# EAGLE design SBC_TMS9918A_ISA (EAGLE 9.6.2)
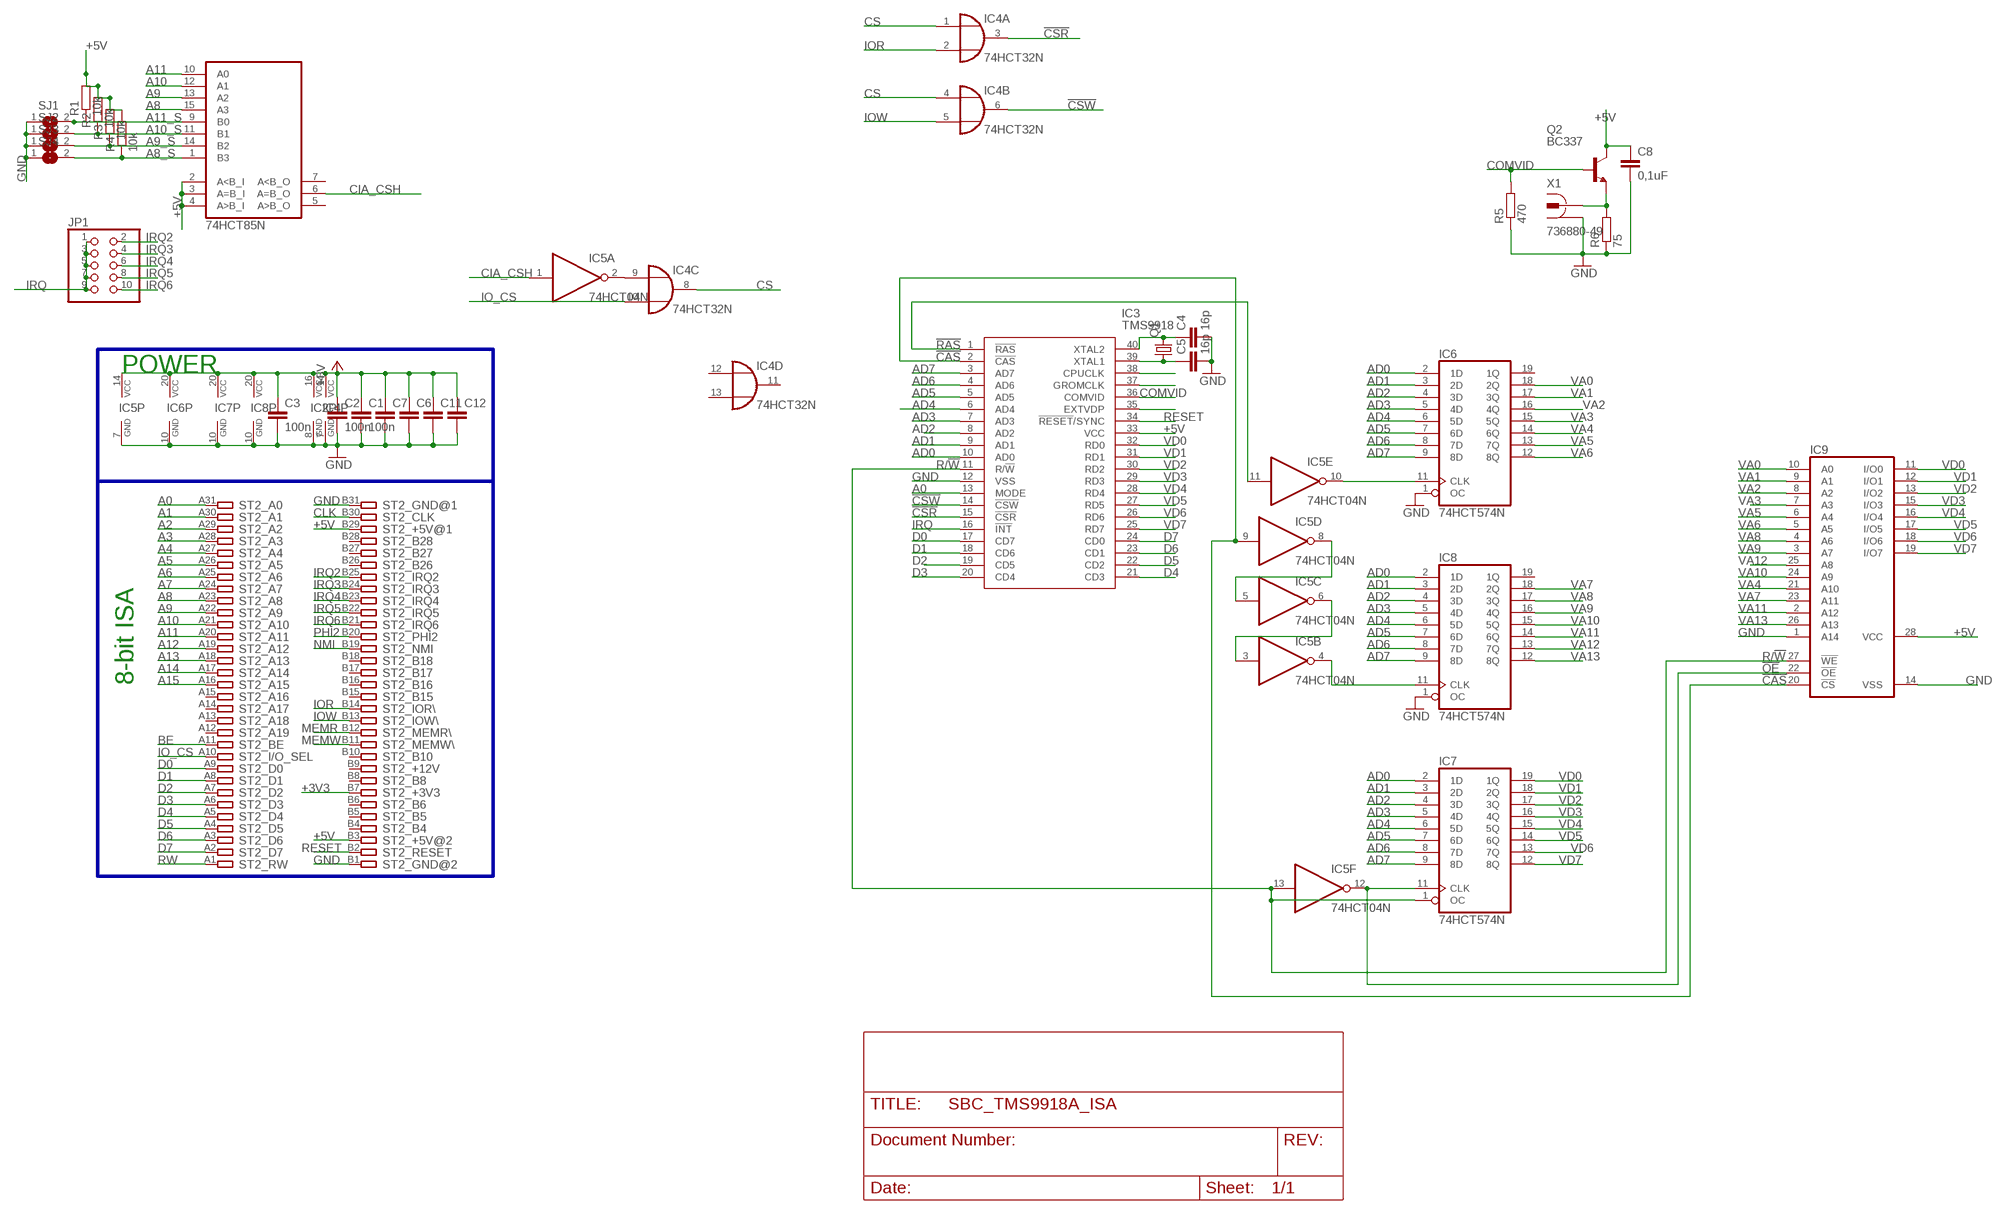
[diagram p0: schematic, sheet 1]

## Parts
C1  100n  C-EU050-025X075  [C050-025X075]
C2  100n  C-EU050-025X075  [C050-025X075]
C3  100n  C-EU050-025X075  [C050-025X075]
C4  16p  C-EU050-024X044  [C050-024X044]
C5  16p  C-EU050-024X044  [C050-024X044]
C6  C-EU050-035X075  [C050-035X075]
C7  C-EU050-035X075  [C050-035X075]
C8  0,1uF  C-EU050-024X044  [C050-024X044]
C11  C-EU050-035X075  [C050-035X075]
C12  C-EU050-035X075  [C050-035X075]
IC2  74HCT85N  [DIL16]
IC3  TMS9918  [DIP1524W53P254L5310H508Q40N]
IC4  74HCT32N  [DIL14]
IC5  74HCT04N  [DIL14]
IC6  74HCT574N  [DIL20]
IC7  74HCT574N  [DIL20]
IC8  74HCT574N  [DIL20]
IC9  62256P  [DIL28-6]
JP1  PINHD-2X5  [2X05]
Q1  CRYSTALHC49S  [HC49/S]
Q2  BC337  [TO92]
R1  10k  R-EU_0207/7  [0207/7]
R2  10k  R-EU_0207/7  [0207/7]
R3  10k  R-EU_0207/7  [0207/7]
R4  10k  R-EU_0207/7  [0207/7]
R5  470  R-EU_0207/7  [0207/7]
R6  75  R-EU_0207/7  [0207/7]
SJ1  SJ  [SJ]
SJ2  SJ  [SJ]
SJ3  SJ  [SJ]
SJ4  SJ  [SJ]
ST2  IBM8BIT_ISASHORT  [APP_2X32_SHORT]
X1  736880-49  [736880-49]

## Nets
!CAS: IC3.2(!CAS) IC5.9(D:I) IC9.20(!CS)
!CSR: IC3.15(!CSR) IC4.3(A:O)
!CSW: IC3.14(!CSW) IC4.6(B:O)
!OE: IC5.12(F:O) IC7.11(CLK) IC9.22(!OE)
!RAS: IC3.1(!RAS) IC5.11(E:I)
+3V3: ST2.B7
+5V [power]: C1.1 C2.1 C3.1 C6.1 C7.1 C8.1 C11.1 C12.1 IC2.2(A<B_I) IC2.3(A=B_I) IC2.4(A>B_I) IC2.16(VCC) IC3.33(VCC) IC4.14(P:VCC) IC5.14(P:VCC) IC6.20(VCC) IC7.20(VCC) IC8.20(VCC) IC9.28(VCC) Q2.3(C) R1.2 R2.2 R3.2 R4.2 ST2.B3 ST2.B29
A0: IC3.13(MODE) ST2.A31
A1: ST2.A30
A2: ST2.A29
A3: ST2.A28
A4: ST2.A27
A5: ST2.A26
A6: ST2.A25
A7: ST2.A24
A8: IC2.15(A3) ST2.A23
A8_S: IC2.1(B3) R4.1 SJ4.2
A9: IC2.13(A2) ST2.A22
A9_S: IC2.14(B2) R3.1 SJ3.2
A10: IC2.12(A1) ST2.A21
A10_S: IC2.11(B1) R2.1 SJ2.2
A11: IC2.10(A0) ST2.A20
A11_S: IC2.9(B0) R1.1 SJ1.2
A12: ST2.A19
A13: ST2.A18
A14: ST2.A17
A15: ST2.A16
AD0: IC3.10(AD0) IC6.2(1D) IC7.2(1D) IC8.2(1D)
AD1: IC3.9(AD1) IC6.3(2D) IC7.3(2D) IC8.3(2D)
AD2: IC3.8(AD2) IC6.4(3D) IC7.4(3D) IC8.4(3D)
AD3: IC3.7(AD3) IC6.5(4D) IC7.5(4D) IC8.5(4D)
AD4: IC3.6(AD4) IC6.6(5D) IC7.6(5D) IC8.6(5D)
AD5: IC3.5(AD5) IC6.7(6D) IC7.7(6D) IC8.7(6D)
AD6: IC3.4(AD6) IC6.8(7D) IC7.8(7D) IC8.8(7D)
AD7: IC3.3(AD7) IC6.9(8D) IC7.9(8D) IC8.9(8D)
BE: ST2.A11
CIA_CSH: IC2.6(A=B_O) IC5.1(A:I)
CLK: ST2.B30
COMVID: IC3.36(COMVID) Q2.2(B) R5.2
CS: IC4.1(A:I0) IC4.4(B:I0) IC4.8(C:O)
D0: IC3.17(CD7) ST2.A9
D1: IC3.18(CD6) ST2.A8
D2: IC3.19(CD5) ST2.A7
D3: IC3.20(CD4) ST2.A6
D4: IC3.21(CD3) ST2.A5
D5: IC3.22(CD2) ST2.A4
D6: IC3.23(CD1) ST2.A3
D7: IC3.24(CD0) ST2.A2
GND [power]: C1.2 C2.2 C3.2 C4.2 C5.2 C6.2 C7.2 C8.2 C11.2 C12.2 IC2.8(GND) IC3.12(VSS) IC4.7(P:GND) IC5.7(P:GND) IC6.1(OC) IC6.10(GND) IC7.10(GND) IC8.1(OC) IC8.10(GND) IC9.1(A14) IC9.14(VSS) R5.1 R6.1 SJ1.1 SJ2.1 SJ3.1 SJ4.1 ST2.B1 ST2.B31 X1.1 X1.1@1 X1.1@2
IO_CS: IC4.10(C:I1) ST2.A10
IOR: IC4.2(A:I1) ST2.B14
IOW: IC4.5(B:I1) ST2.B13
IRQ: IC3.16(!INT) JP1.1 JP1.3 JP1.5 JP1.7 JP1.9
IRQ2: JP1.2 ST2.B25
IRQ3: JP1.4 ST2.B24
IRQ4: JP1.6 ST2.B23
IRQ5: JP1.8 ST2.B22
IRQ6: JP1.10 ST2.B21
MEMR: ST2.B12
MEMW: ST2.B11
N$2: IC4.9(C:I0) IC5.2(A:O)
N$3: Q2.1(E) R6.2 X1.2
N$14: IC5.10(E:O) IC6.11(CLK)
N$15: IC5.5(C:I) IC5.8(D:O)
N$16: IC5.3(B:I) IC5.6(C:O)
N$17: IC5.4(B:O) IC8.11(CLK)
N$22: C4.1 IC3.40(XTAL2) Q1.2
N$23: C5.1 IC3.39(XTAL1) Q1.1
N$24: IC3.38(CPUCLK)
N$25: IC3.37(GROMCLK)
N$27: IC3.35(EXTVDP)
NMI: ST2.B19
PHI2: ST2.B20
R/!W: IC3.11(R/!W) IC5.13(F:I) IC7.1(OC) IC9.27(!WE)
RESET: IC3.34(!RESET!/SYNC) ST2.B2
RW: ST2.A1
VA0: IC6.18(2Q) IC9.10(A0)
VA1: IC6.17(3Q) IC9.9(A1)
VA2: IC6.16(4Q) IC9.8(A2)
VA3: IC6.15(5Q) IC9.7(A3)
VA4: IC6.14(6Q) IC9.21(A10)
VA5: IC6.13(7Q) IC9.6(A4)
VA6: IC6.12(8Q) IC9.5(A5)
VA7: IC8.18(2Q) IC9.23(A11)
VA8: IC8.17(3Q) IC9.4(A6)
VA9: IC8.16(4Q) IC9.3(A7)
VA10: IC8.15(5Q) IC9.24(A9)
VA11: IC8.14(6Q) IC9.2(A12)
VA12: IC8.13(7Q) IC9.25(A8)
VA13: IC8.12(8Q) IC9.26(A13)
VD0: IC3.32(RD0) IC7.19(1Q) IC9.11(I/O0)
VD1: IC3.31(RD1) IC7.18(2Q) IC9.12(I/O1)
VD2: IC3.30(RD2) IC7.17(3Q) IC9.13(I/O2)
VD3: IC3.29(RD3) IC7.16(4Q) IC9.15(I/O3)
VD4: IC3.28(RD4) IC7.15(5Q) IC9.16(I/O4)
VD5: IC3.27(RD5) IC7.14(6Q) IC9.17(I/O5)
VD6: IC3.26(RD6) IC7.13(7Q) IC9.18(I/O6)
VD7: IC3.25(RD7) IC7.12(8Q) IC9.19(I/O7)
Unconnected: IC2.5(A>B_O) IC2.7(A<B_O) IC4.11(D:O) IC4.12(D:I0) IC4.13(D:I1) IC6.19(1Q) IC8.19(1Q) ST2.A12 ST2.A13 ST2.A14 ST2.A15 ST2.B4 ST2.B5 ST2.B6 ST2.B8 ST2.B9 ST2.B10 ST2.B15 ST2.B16 ST2.B17 ST2.B18 ST2.B26 ST2.B27 ST2.B28

## Buses
A8,A9,A10,A11,ACIA_CS,IO_CS,IO_CS_N,N$3,N$4,N$8

## Notes on the sheet
- POWER
- 8-bit ISA

## Library data of the parts
C1-C3 = rcl:C-EU: CAPACITOR, European symbol
C4-C8 C11 C12 = rcl:C-EU: CAPACITOR, European symbol; SPICEPREFIX: C
IC2 = 74xx-eu:74*85: 4-bit magnitude COMPARATOR
IC3 = TMS9918:TMS9918: Video Display Processor, DIP-40 Source: Datasheet <http://www.bitsavers.org/components/ti/TMS9900/TMS9918A_TMS9928A_TMS9929A_Video_Display_Processors_Data_Manual_Nov82.pdf>; DESCRIPTION: Video Display Processor, DIP-40; HEIGHT: 5.08mm; MANUFACTURER_NAME: Texas Instruments; MANUFACTURER_PART_NUMBER: TMS9918
IC4 = 74xx-eu:74*32: Quad 2-input OR gate
IC5 = 74xx-eu:74*04: Hex INVERTER
IC6-IC8 = 74xx-eu:74*574: 8-bit D type FLIP FLOP bus driver
IC9 = memory-hitachi:62256P: MEMORY; OC_FARNELL: unknown; OC_NEWARK: unknown
JP1 = pinhead:PINHD-2X5: PIN HEADER
Q1 = crystal:CRYSTAL: CRYSTAL; OC_FARNELL: 1667008; OC_NEWARK: unknown
Q2 = transistor-npn:BC337*: NPN Transistor
R1-R6 = rcl:R-EU_: RESISTOR, European symbol; SPICEPREFIX: R
SJ1-SJ4 = jumper:SJ: SMD solder JUMPER
ST2 = TiRoRiN_Libs:IBM8BIT_ISA: 8-bit CARD IBM/PC-AT
X1 = con-conrad:736880-49: Cinch Connector ( RCA Jack ) Cinch-Einbaukupplung 90º 72345 Vernickelt BKL Electronic Source: Conrad <http://www.conrad.de/ce/de/product/736880>

## Net classes
0 default: width 0.381 mm, drill 0.2 mm, clearance 0.254 mm
1 power: width 0.508 mm, drill 0.66 mm, clearance 0.254 mm to class 0, clearance 0.254 mm
2 data: width 0.381 mm, drill 0.66 mm, clearance 0.254 mm to class 0, clearance 0.254 mm to class 1, clearance 0.254 mm

## Board
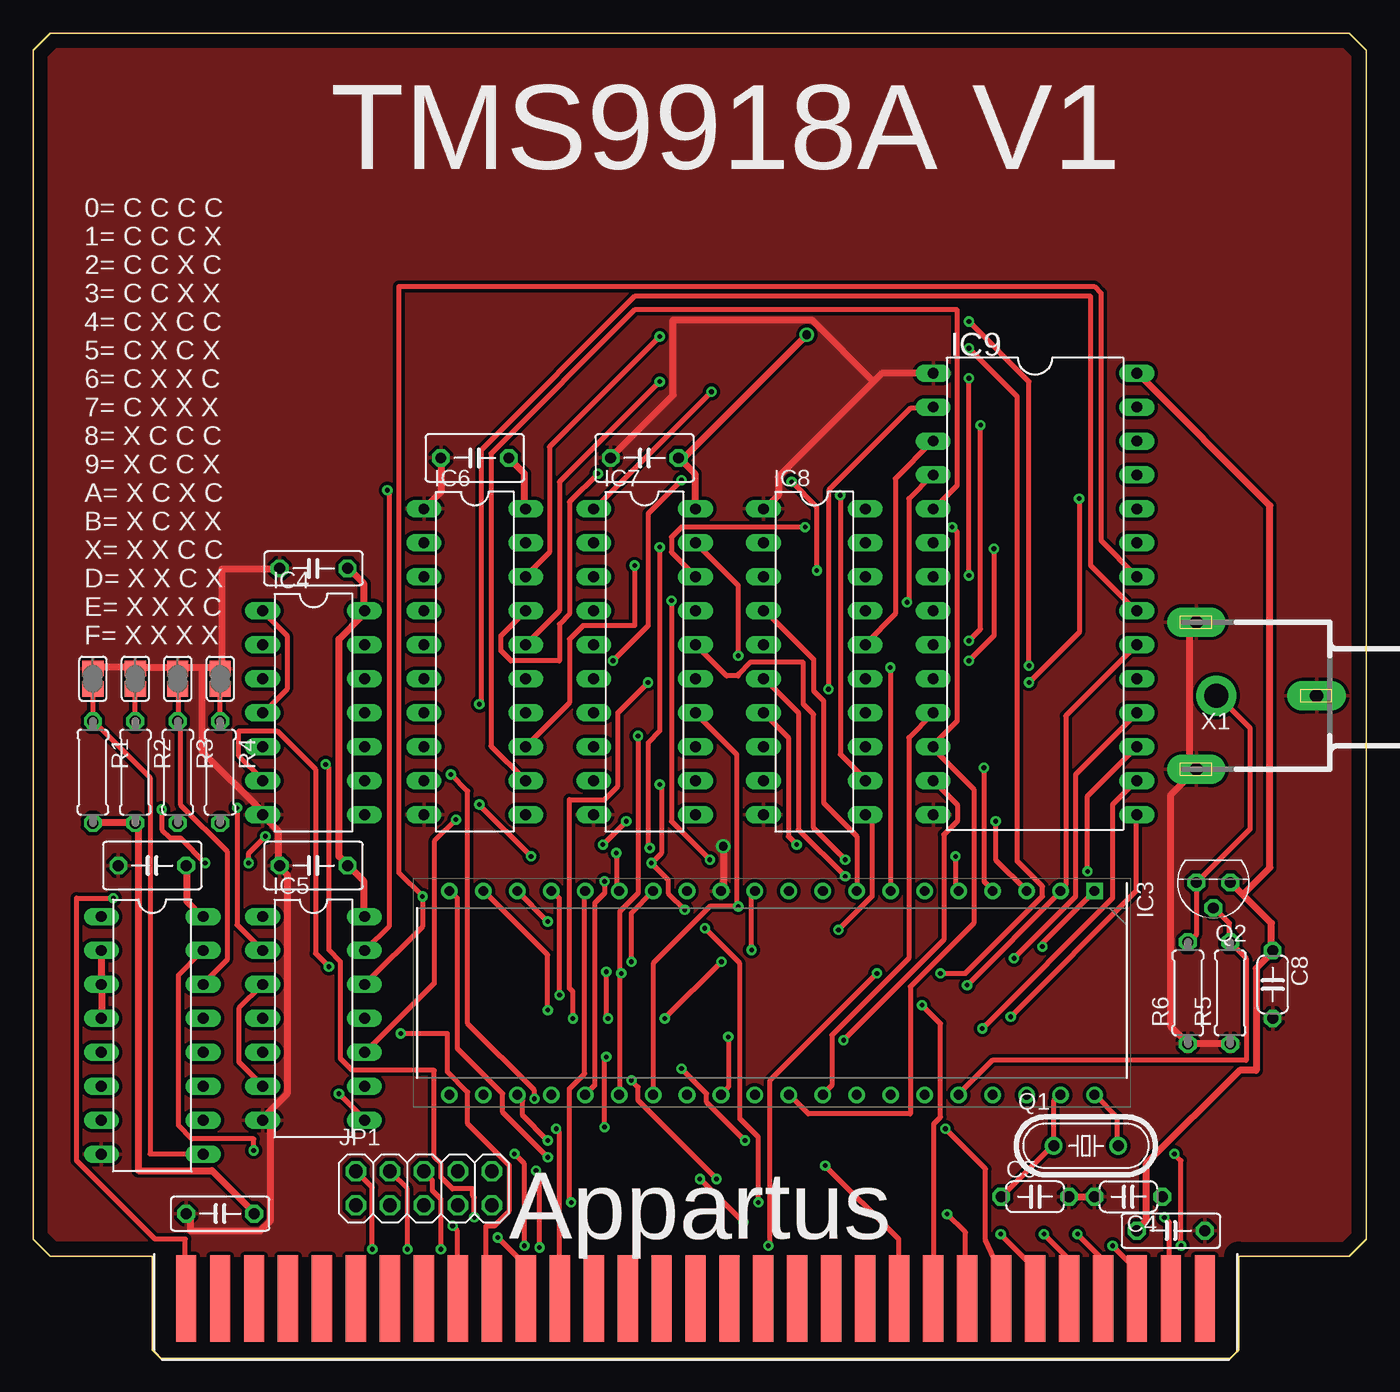
[diagram p1: board, top side]
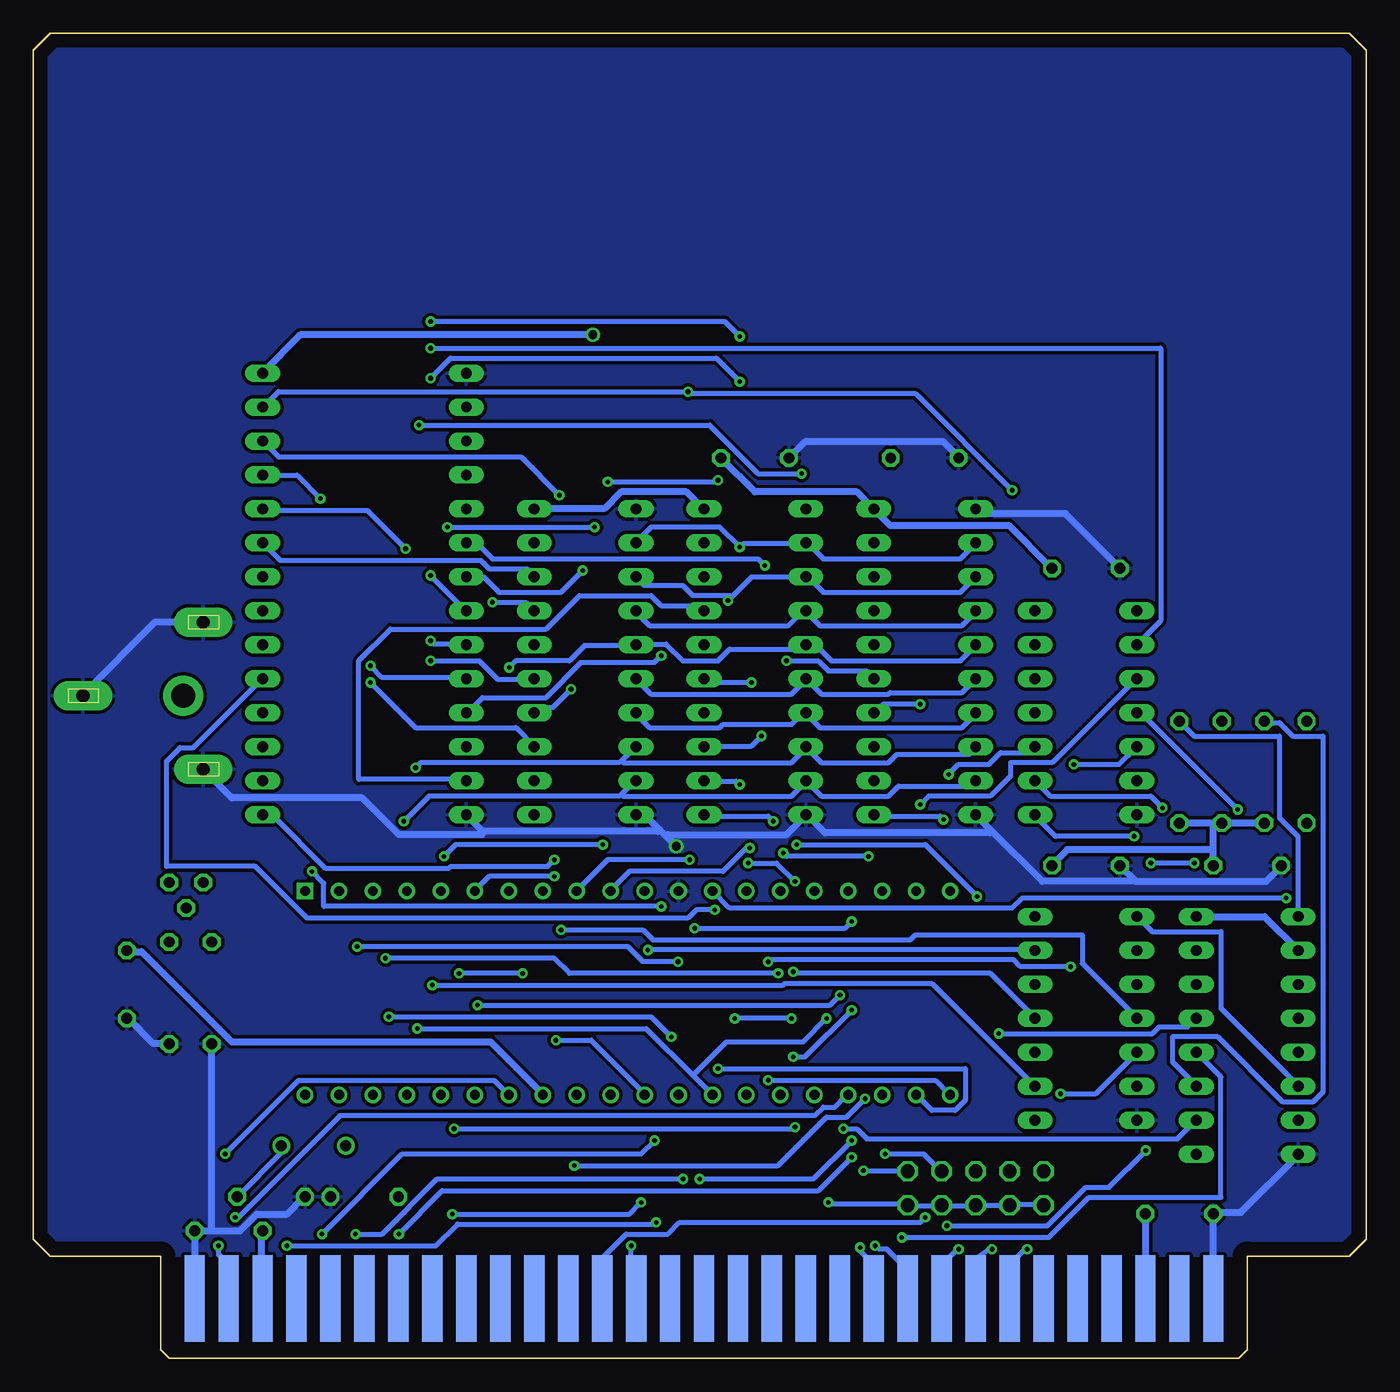
[diagram p2: board, bottom side, seen from below]

Size 99.7 x 99.06 mm. Coordinates in mm from the lower left corner, seen from the top.
Copper layers (1*16): Top 0.035mm / dielectric 1.5mm / Bottom 0.035mm
Design rules "appartus": minimum track width 6mil, minimum drill 0.35mm, track to track 6mil, track to pad 6mil, pad to pad 6mil, via to via 6mil, smd to smd 6mil, copper to edge 40mil, drill to drill 6mil, minimum pad ring 10mil, minimum via ring 8mil, stop-mask expansion 4mil, vias tented up to drill 0mil, thermal gap 10mil

### Footprints (pad centres in the part's own frame; a part is rotated, then mirrored left to right if it is on the bottom)
C050-025X075 = drill 0.813 octagon: 1 -2.54,0; 2 2.54,0
C050-024X044 = drill 0.813 octagon: 1 -2.54,0; 2 2.54,0
C050-035X075 = drill 0.813 octagon: 1 -2.54,0; 2 2.54,0
DIL16 = drill 0.813 long: 1 -8.89,-3.81; 2 -6.35,-3.81; 3 -3.81,-3.81; 4 -1.27,-3.81; 5 1.27,-3.81; 6 3.81,-3.81; 7 6.35,-3.81; 8 8.89,-3.81; 9 8.89,3.81; 10 6.35,3.81; 11 3.81,3.81; 12 1.27,3.81; 13 -1.27,3.81; 14 -3.81,3.81; 15 -6.35,3.81; 16 -8.89,3.81
DIP1524W53P254L5310H508Q40N = drill 0.733 pad 1.133 square: 1 -7.62,24.13 | drill 0.733 pad 1.133: 2 -7.62,21.59; 3 -7.62,19.05; 4 -7.62,16.51; 5 -7.62,13.97; 6 -7.62,11.43; 7 -7.62,8.89; 8 -7.62,6.35; 9 -7.62,3.81; 10 -7.62,1.27; 11 -7.62,-1.27; 12 -7.62,-3.81; 13 -7.62,-6.35; 14 -7.62,-8.89; 15 -7.62,-11.43; 16 -7.62,-13.97; 17 -7.62,-16.51; 18 -7.62,-19.05; 19 -7.62,-21.59; 20 -7.62,-24.13; 21 7.62,-24.13; 22 7.62,-21.59; 23 7.62,-19.05; 24 7.62,-16.51; 25 7.62,-13.97; 26 7.62,-11.43; 27 7.62,-8.89; 28 7.62,-6.35; 29 7.62,-3.81; 30 7.62,-1.27; 31 7.62,1.27; 32 7.62,3.81; 33 7.62,6.35; 34 7.62,8.89; 35 7.62,11.43; 36 7.62,13.97; 37 7.62,16.51; 38 7.62,19.05; 39 7.62,21.59; 40 7.62,24.13
DIL14 = drill 0.813 long: 1 -7.62,-3.81; 2 -5.08,-3.81; 3 -2.54,-3.81; 4 0,-3.81; 5 2.54,-3.81; 6 5.08,-3.81; 7 7.62,-3.81; 8 7.62,3.81; 9 5.08,3.81; 10 2.54,3.81; 11 0,3.81; 12 -2.54,3.81; 13 -5.08,3.81; 14 -7.62,3.81
DIL20 = drill 0.813 long: 1 -11.43,-3.81; 2 -8.89,-3.81; 3 -6.35,-3.81; 4 -3.81,-3.81; 5 -1.27,-3.81; 6 1.27,-3.81; 7 3.81,-3.81; 8 6.35,-3.81; 9 8.89,-3.81; 10 11.43,-3.81; 11 11.43,3.81; 12 8.89,3.81; 13 6.35,3.81; 14 3.81,3.81; 15 1.27,3.81; 16 -1.27,3.81; 17 -3.81,3.81; 18 -6.35,3.81; 19 -8.89,3.81; 20 -11.43,3.81
DIL28-6 = drill 0.813 long: 1 -16.51,-7.62; 2 -13.97,-7.62; 3 -11.43,-7.62; 4 -8.89,-7.62; 5 -6.35,-7.62; 6 -3.81,-7.62; 7 -1.27,-7.62; 8 1.27,-7.62; 9 3.81,-7.62; 10 6.35,-7.62; 11 8.89,-7.62; 12 11.43,-7.62; 13 13.97,-7.62; 14 16.51,-7.62; 15 16.51,7.62; 16 13.97,7.62; 17 11.43,7.62; 18 8.89,7.62; 19 6.35,7.62; 20 3.81,7.62; 21 1.27,7.62; 22 -1.27,7.62; 23 -3.81,7.62; 24 -6.35,7.62; 25 -8.89,7.62; 26 -11.43,7.62; 27 -13.97,7.62; 28 -16.51,7.62
2X05 = drill 1.016 octagon: 1 -5.08,-1.27; 2 -5.08,1.27; 3 -2.54,-1.27; 4 -2.54,1.27; 5 0,-1.27; 6 0,1.27; 7 2.54,-1.27; 8 2.54,1.27; 9 5.08,-1.27; 10 5.08,1.27
HC49/S = drill 0.813: 1 -2.413,0; 2 2.413,0
TO92 = drill 0.813 octagon: 1 1.27,0; 2 0,1.905; 3 -1.27,0
0207/7 = drill 0.813 octagon: 1 -3.81,0; 2 3.81,0
SJ = smd 1.168 x 1.6: 1 -0.762,0; 2 0.762,0
APP_2X32_SHORT = smd 1.524 x 6.477: A1 38.1,-44.45; A2 35.56,-44.45; A3 33.02,-44.45; A4 30.48,-44.45; A5 27.94,-44.45; A6 25.4,-44.45; A7 22.86,-44.45; A8 20.32,-44.45; A9 17.78,-44.45; A10 15.24,-44.45; A11 12.7,-44.45; A12 10.16,-44.45; A13 7.62,-44.45; A14 5.08,-44.45; A15 2.54,-44.45; A16 0,-44.45; A17 -2.54,-44.45; A18 -5.08,-44.45; A19 -7.62,-44.45; A20 -10.16,-44.45; A21 -12.7,-44.45; A22 -15.24,-44.45; A23 -17.78,-44.45; A24 -20.32,-44.45; A25 -22.86,-44.45; A26 -25.4,-44.45; A27 -27.94,-44.45; A28 -30.48,-44.45; A29 -33.02,-44.45; A30 -35.56,-44.45; A31 -38.1,-44.45 | smd 1.524 x 6.477 bottom: B1 38.1,-44.45; B2 35.56,-44.45; B3 33.02,-44.45; B4 30.48,-44.45; B5 27.94,-44.45; B6 25.4,-44.45; B7 22.86,-44.45; B8 20.32,-44.45; B9 17.78,-44.45; B10 15.24,-44.45; B11 12.7,-44.45; B12 10.16,-44.45; B13 7.62,-44.45; B14 5.08,-44.45; B15 2.54,-44.45; B16 0,-44.45; B17 -2.54,-44.45; B18 -5.08,-44.45; B19 -7.62,-44.45; B20 -10.16,-44.45; B21 -12.7,-44.45; B22 -15.24,-44.45; B23 -17.78,-44.45; B24 -20.32,-44.45; B25 -22.86,-44.45; B26 -25.4,-44.45; B27 -27.94,-44.45; B28 -30.48,-44.45; B29 -33.02,-44.45; B30 -35.56,-44.45; B31 -38.1,-44.45
736880-49 = drill 1 pad 2.2 long: 1 -3.92,0; 1@1 5.08,-5.5; 1@2 5.08,5.5 | drill 1.8 pad 3: 2 3.58,0

### Placement (x,y rotation side)
C1  13.97,10.8 180 top
C2  85.09,9.53 0 top
C3  20.96,59.05 180 top
C4  81.92,12.07 180 top
C5  74.93,12.07 0 top
C6  8.89,36.83 180 top
C7  20.96,36.83 180 top
C8  92.71,27.94 270 top
C11  33.02,67.31 180 top
C12  45.72,67.31 180 top
IC2  8.89,24.13 270 top
IC3  55.25,27.31 270 top
IC4  20.96,48.26 270 top
IC5  20.96,25.4 270 top
IC6  33.02,52.07 270 top
IC7  45.72,52.07 270 top
IC8  58.42,52.07 270 top
IC9  74.93,57.15 270 top
JP1  29.21,12.7 0 top
Q1  78.74,15.88 0 top
Q2  88.27,35.56 180 top
R1  4.45,43.82 270 top
R2  7.62,43.82 270 top
R3  10.8,43.82 270 top
R4  13.97,43.82 270 top
R5  89.54,27.31 90 top
R6  86.36,27.31 90 top
SJ1  4.45,50.8 270 top
SJ2  7.62,50.8 270 top
SJ3  10.8,50.8 270 top
SJ4  13.97,50.8 270 top
ST2  49.53,48.9 0 top
X1  92.08,49.53 180 top

### Tracks (layer width: path | path; a pad name or v marks a point on that pad's centre or on a via)
!CAS  (via drill 0.35)
  Top 0.381: IC9.20 77.23,48.02 77.23,35.4 76.86,35.02 IC3.2 76.73,34.77 v69.86,27.9
  Bottom 0.381: v69.86,27.9 43.61,27.9 43.48,28.02 32.48,28.02 24.86,20.4 IC5.9
!CSR  (via drill 0.35)
  Top 0.381: v43.61,37.77 43.61,35.15 43.73,35.02 IC3.15 | v33.36,41.4 v37.23,37.52
  Bottom 0.381: v43.61,37.77 43.36,37.52 v37.23,37.52 | v33.36,41.4 32.73,42.02 28.11,42.02 26.61,43.52 26.61,44.52 23.48,44.52 17.23,50.77 IC4.3
!CSW  (via drill 0.35)
  Top 0.381: v44.73,29.65 44.73,33.27 46.36,34.9 IC3.14 | v22.11,29.27 21.11,30.27 21.11,44.02 18.23,46.9 15.36,46.9 15.36,45.02 17.11,43.27 IC4.6
  Bottom 0.381: v44.73,29.65 44.61,29.77 26.36,29.77 25.86,29.27 v22.11,29.27
!OE  (via drill 0.35)
  Top 0.381: v44.36,40.15 v42.61,38.4 | IC5.12 24.86,28.02 29.11,32.27 v29.11,34.52 27.36,36.27 27.36,80.15 79.36,80.15 79.86,79.65 79.86,61.15 82.48,58.52 IC9.22
  Bottom 0.381: v29.11,34.52 32.98,38.4 v42.61,38.4 | v44.36,40.15 44.73,40.52 49.48,40.52 IC7.11
!RAS  (via drill 0.35)
  Top 0.381: v75.48,30.77 75.48,31.02 79.36,34.9 IC3.1 | v47.23,25.4 v51.48,29.65 | v42.98,25.4 42.86,25.52 v42.86,28.9
  Bottom 0.381: v75.48,30.77 55.23,30.77 54.11,29.65 v51.48,29.65 | v42.98,25.4 v47.23,25.4 | v42.86,28.9 42.73,28.77 28.11,28.77 24.86,25.52 IC5.11
+5V  (via drill 0.66)
  Top 0.508: 90.48,34.65 92.61,32.52 92.61,30.52 C8.1 92.61,30.27 91.48,29.15 91.48,21.52 90.23,21.52 83.23,14.52 83.23,10.27 82.61,9.65 C2.1 | 90.48,34.65 89.61,35.52 Q2.3 | IC9.28 82.61,73.65 92.51,63.74 92.51,36.68 90.48,34.65 | IC7.20 49.48,63.52 49.48,66.15 48.36,67.27 C12.1 48.61,67.27 v57.86,76.52 | C3.1 23.61,59.02 24.73,57.9 24.73,55.9 IC4.14 24.73,55.65 22.86,53.77 22.86,37.52 23.36,37.02 C7.1 23.61,36.77 24.73,35.65 24.73,33.02 IC5.14 | C11.1 35.61,67.27 36.73,66.15 36.73,63.52 IC6.20 | IC2.4 5.11,25.52 5.11,27.9 IC2.3 5.11,28.15 5.11,30.4 IC2.2 | R1.2 4.48,40.02 7.61,40.02 R2.2 7.86,39.9 7.86,14.02 13.36,14.02 16.48,10.9 C1.1 | IC2.16 12.61,33.02 11.48,34.15 11.48,36.77 C6.1
  Bottom 0.508: C2.1 82.61,9.52 82.61,4.52 ST2.B3 | IC3.33 61.61,19.77 65.48,23.65 84.86,23.65 91.61,30.4 92.61,30.4 C8.1 | IC8.20 62.23,63.52 56.98,63.52 55.73,64.77 50.86,64.77 49.61,63.52 IC7.20 | C3.1 23.61,59.15 26.73,62.27 35.61,62.27 36.73,63.4 IC6.20 36.98,63.65 38.11,64.77 45.73,64.77 48.23,67.27 C12.1 | C1.1 16.48,10.77 16.48,4.52 ST2.B29 | 11.48,40.02 13.86,40.02 R4.2 | 11.48,40.02 10.86,40.02 R3.2 10.61,40.02 7.73,40.02 R2.2 | 11.48,40.02 11.48,38.02 | 11.48,38.02 11.48,36.9 C6.1 | IC2.16 7.61,33.02 5.11,30.52 IC2.2 | 11.48,38.02 22.36,38.02 23.48,36.9 C7.1 | v57.86,76.52 79.73,76.52 82.48,73.77 IC9.28
A0  (via drill 0.35)
  Top 0.381: v5.98,34.4 3.23,34.4 3.23,14.77 9.11,8.9 11.36,8.9 11.36,4.52 ST2.A31
  Bottom 0.381: v5.98,34.4 25.73,34.4 26.48,33.65 47.61,33.65 48.86,34.9 IC3.13
A8  (via drill 0.35)
  Top 0.381: v16.48,15.52 16.48,16.4 11.86,16.4 10.86,17.4 10.86,28.65 12.61,30.4 IC2.15 | v31.36,9.9 31.73,9.52 31.73,4.52 ST2.A23
  Bottom 0.381: v16.48,15.52 19.23,12.77 20.98,12.77 23.86,9.9 v31.36,9.9
A8_S
  Top 0.381: SJ4.2 13.98,50.02 13.98,47.65 R4.1
  Bottom 0.381: IC2.1 5.11,33.02 5.11,39.02 6.48,40.4 6.48,46.52 12.86,46.52 13.86,47.52 R4.1
A9  (via drill 0.35)
  Top 0.381: v27.48,24.27 30.98,24.27 30.98,21.4 32.48,19.9 32.48,17.52 35.61,14.4 35.61,11.02 34.48,9.9 33.86,9.9 33.86,4.9 34.23,4.52 ST2.A22
  Bottom 0.381: v27.48,24.27 15.98,24.27 15.48,24.77 13.36,24.77 12.73,25.4 IC2.13
A9_S
  Top 0.381: SJ3.2 10.86,50.02 10.86,47.65 R3.1 10.98,47.52 10.98,41.4 14.48,37.9 14.48,29.77 12.73,28.02 IC2.14
A10  (via drill 0.35)
  Top 0.381: v34.73,9.02 36.73,7.02 36.73,4.52 ST2.A21
  Bottom 0.381: v34.73,9.02 23.73,9.02 20.73,12.02 10.86,12.02 10.86,21.02 12.61,22.77 IC2.12
A10_S
  Top 0.381: SJ2.2 7.61,50.02 7.61,47.65 R2.1
  Bottom 0.381: IC2.11 12.73,20.4 14.48,22.15 14.48,24.02 11.11,24.02 6.23,19.15 3.98,19.15 3.23,19.9 3.23,46.52 5.48,46.52 6.48,47.52 7.61,47.52 R2.1
A11  (via drill 0.35)
  Top 0.381: v39.11,17.15 39.36,16.9 39.36,4.52 ST2.A20
  Bottom 0.381: v39.11,17.15 38.11,17.15 37.36,16.4 14.11,16.4 12.73,17.77 IC2.10
A11_S
  Top 0.381: SJ1.2 4.48,50.02 4.48,47.65 R1.1 4.61,47.52 8.73,43.4 8.73,15.27 12.61,15.27 IC2.9
AD0  (via drill 0.35)
  Top 0.381: v46.11,38.15 45.98,38.27 45.98,46.02 46.86,46.9 v46.86,60.65
  Bottom 0.381: v46.11,38.15 46.36,38.15 48.11,36.4 55.11,36.4 56.48,35.02 IC3.10 | IC6.2 29.23,60.9 30.36,59.77 40.61,59.77 41.73,60.9 IC7.2 41.98,60.9 46.61,60.9 v46.86,60.65 48.36,62.15 53.48,62.15 54.61,61.02 IC8.2
AD1  (via drill 0.35)
  Top 0.381: v50.61,37.27 47.73,40.15 v47.73,56.65
  Bottom 0.381: v50.61,37.27 56.73,37.27 58.98,35.02 IC3.9 | IC6.3 29.23,58.4 30.36,57.27 40.61,57.27 41.73,58.4 IC7.3 41.98,58.4 45.98,58.4 v47.73,56.65 47.61,57.02 50.36,57.02 51.11,57.77 53.98,57.77 54.61,58.4 IC8.3
AD2
  Top 0.381: IC3.8 61.61,35.02 61.61,39.02 59.11,41.52 59.11,49.15 58.36,49.9 58.36,52.27 54.73,55.9 IC8.4
  Bottom 0.381: IC6.4 29.23,55.77 30.23,54.77 40.86,54.77 41.86,55.77 IC7.4 42.11,55.9 43.23,54.77 53.61,54.77 54.61,55.77 IC8.4
AD3  (via drill 0.35)
  Top 0.381: v64.11,51.65 64.11,35.02 IC3.7
  Bottom 0.381: IC6.5 29.23,53.27 30.36,52.15 39.98,52.15 41.11,53.27 41.86,53.27 IC7.5 41.98,53.15 42.11,53.02 47.61,53.02 48.48,52.15 51.11,52.15 52.36,53.4 54.48,53.4 IC8.5 54.73,53.27 58.48,53.27 59.61,52.15 63.61,52.15 v64.11,51.65
AD4  (via drill 0.35)
  Top 0.381: v60.73,36.02 57.23,39.52 57.23,48.27 54.73,50.77 IC8.6
  Bottom 0.381: IC6.6 29.23,50.77 30.23,49.77 35.61,49.77 35.73,49.65 40.73,49.65 41.86,50.77 IC7.6 41.98,50.65 42.98,49.65 53.48,49.65 54.61,50.77 IC8.6 | v60.73,36.02 65.61,36.02 66.61,35.02 IC3.6
AD5  (via drill 0.35)
  Top 0.381: v68.98,37.52 68.98,35.15 69.11,35.02 IC3.5 | v57.11,38.4 56.48,39.02 56.48,46.4 54.73,48.15 IC8.7
  Bottom 0.381: IC6.7 29.23,48.15 30.23,47.15 40.86,47.15 41.86,48.15 IC7.7 42.11,48.27 42.98,47.4 48.11,47.4 48.36,47.15 53.61,47.15 54.61,48.15 IC8.7 | v68.98,37.52 68.11,38.4 v57.11,38.4
AD6  (via drill 0.35)
  Top 0.381: v71.11,44.15 71.11,35.65 71.73,35.02 IC3.4
  Bottom 0.381: IC6.8 29.23,45.65 29.73,45.15 35.11,45.15 35.73,44.52 40.73,44.52 41.86,45.65 IC7.8 41.98,45.52 42.98,44.52 55.61,44.52 55.73,44.65 | v71.11,44.15 70.73,44.52 55.86,44.52 55.73,44.65 | 55.73,44.65 54.73,45.65 IC8.8
AD7  (via drill 0.35)
  Top 0.381: v71.98,40.15 71.98,37.27 74.23,35.02 IC3.3
  Bottom 0.381: IC6.9 29.23,43.15 29.61,42.77 34.98,42.77 35.73,42.02 40.73,42.02 41.86,43.15 IC7.9 41.98,43.02 42.98,42.02 55.61,42.02 55.73,42.15 | v71.98,40.15 70.11,42.02 55.86,42.02 55.73,42.15 | 55.73,42.15 54.73,43.15 IC8.9
CIA_CSH
  Bottom 0.381: IC2.6 5.11,20.4 10.86,26.15 10.86,31.9 15.98,31.9 17.11,33.02 IC5.1
COMVID
  Top 0.381: IC3.36 69.23,19.77 71.73,22.27 90.73,22.27 90.73,29.9 89.61,31.02 R5.2 89.48,31.27 89.48,32.52 88.36,33.65 Q2.2
CS  (via drill 0.35)
  Top 0.381: IC4.4 17.23,48.27 18.98,50.02 18.98,54.02 17.23,55.77 IC4.1 | v17.36,39.02 16.11,37.77 v16.11,37.02 | v12.86,37.02 10.98,38.9 10.23,38.9 9.61,39.52 v9.61,41.02
  Bottom 0.381: v17.36,39.02 23.23,39.02 24.73,40.52 IC4.8 | v12.86,37.02 v16.11,37.02 | v9.61,41.02 16.73,48.15 17.11,48.15 IC4.4
D0  (via drill 0.35)
  Top 0.381: v39.36,27.15 39.36,34.4 38.86,34.9 IC3.17 | v66.48,26.4 67.86,25.02 67.86,18.02 67.36,17.52 67.36,4.52 ST2.A9
  Bottom 0.381: v39.36,27.15 40.11,26.4 v66.48,26.4
D1  (via drill 0.35)
  Top 0.381: v38.48,32.65 36.23,34.9 IC3.18 | v50.23,32.15 52.86,29.52 52.86,17.9 54.23,16.52 v54.23,11.65 | v68.36,10.77 69.73,9.4 69.73,4.52 ST2.A8
  Bottom 0.381: v38.48,32.65 38.98,32.15 v50.23,32.15 | v54.23,11.65 55.11,10.77 v68.36,10.77
D2  (via drill 0.35)
  Top 0.381: v38.48,26.02 38.48,30.15 33.73,34.9 IC3.19 | v42.86,22.52 42.73,22.4 v42.73,17.27 | v68.23,17.15 71.23,14.15 71.23,8.84 72.39,6.35 ST2.A7
  Bottom 0.381: v38.48,26.02 41.98,22.52 v42.86,22.52 | v42.73,17.27 42.86,17.15 v68.23,17.15
D3  (via drill 0.35)
  Top 0.381: v38.48,15.02 35.11,18.4 35.11,19.77 31.73,23.15 31.73,34.4 31.23,34.9 IC3.20 | v72.36,9.27 74.86,6.77 74.86,4.52 ST2.A6
  Bottom 0.381: v38.48,15.02 40.98,12.52 69.11,12.52 v72.36,9.27
D4  (via drill 0.35)
  Top 0.381: v44.73,20.77 45.23,20.27 45.23,19.27 v51.11,13.4 | v75.61,9.27 77.36,7.52 77.36,4.52 ST2.A5
  Bottom 0.381: v44.73,20.77 32.23,20.77 31.23,19.77 IC3.21 | v51.11,13.4 69.48,13.4 73.61,9.27 v75.61,9.27
D5  (via drill 0.35)
  Top 0.381: v48.48,21.65 50.36,19.77 50.36,19.15 v53.23,16.27 | v78.11,9.27 79.98,7.4 79.98,4.52 ST2.A4
  Bottom 0.381: v48.48,21.65 29.98,21.65 29.98,19.27 30.73,18.52 32.48,18.52 33.61,19.65 IC3.22 | v53.23,16.27 54.23,15.27 72.11,15.27 v78.11,9.27
D6  (via drill 0.35)
  Top 0.381: v38.48,16.27 36.61,18.15 36.61,19.27 36.23,19.65 IC3.23 | v53.11,10.15 v49.86,13.4 | v80.73,8.4 82.48,6.65 82.48,4.52 ST2.A3
  Bottom 0.381: v38.48,16.27 41.36,13.4 v49.86,13.4 | v53.11,10.15 53.23,10.02 67.98,10.02 69.61,8.4 v80.73,8.4
D7  (via drill 0.35)
  Top 0.381: v84.61,10.52 84.98,10.15 84.98,4.52 ST2.A2
  Bottom 0.381: v84.61,10.52 84.36,10.52 76.73,18.15 41.23,18.15 40.61,18.77 39.73,18.77 38.86,19.65 IC3.24
GND  (via drill 0.66)
  Top 0.508: X1.1@1 86.98,55.02 86.48,54.52 86.48,44.65 86.98,44.15 X1.1@2 86.86,43.9 85.11,42.15 85.11,24.77 86.23,23.65 R6.1 86.48,23.52 89.48,23.52 R5.1 | C5.2 77.48,12.02 79.36,12.02 C4.2 | v51.61,38.27 51.61,35.15 51.48,35.02 IC3.12 | C1.2 11.48,10.77 11.73,10.52 11.73,9.52 16.98,9.52 17.73,10.27 17.73,17.27 17.23,17.77 IC5.7 17.23,18.02 18.98,19.77 18.98,36.15 18.48,36.65 C7.2 18.36,36.9 18.36,39.4 17.23,40.52 IC4.7 17.11,40.9 12.61,45.4 12.61,51.65 | 62.86,73.02 63.48,73.65 67.23,73.65 IC9.1 | 62.86,73.02 55.73,65.9 55.73,64.52 54.73,63.52 IC8.1 | IC6.1 30.48,64.77 C11.2 | SJ1.1 4.48,51.65 7.61,51.65 SJ2.1 7.86,51.65 10.73,51.65 SJ3.1 10.98,51.65 12.61,51.65 | 12.61,51.65 13.86,51.65 SJ4.1 14.11,51.77 14.11,59.02 18.36,59.02 C3.2 | 62.86,73.02 58.23,77.65 47.86,77.65 47.86,72.02 43.23,67.4 C12.2
  Bottom 0.508: X1.1 95.98,49.65 90.61,55.02 87.11,55.02 X1.1@1 | C8.2 92.61,25.4 90.73,23.52 89.61,23.52 R5.1 | ST2.B1 87.61,4.52 87.61,9.52 C2.2 87.36,9.52 86.36,9.52 | 86.36,9.52 84.23,9.52 82.98,10.77 80.73,10.77 79.48,12.02 C4.2 | 86.36,9.52 86.36,23.4 R6.1 | 52.86,39.52 53.86,40.52 54.61,40.52 IC8.10 | 52.86,39.52 52.36,39.02 | 52.36,39.02 v51.61,38.27 | 52.36,39.02 52.23,39.15 43.36,39.15 41.98,40.52 IC7.10 41.73,40.52 40.48,39.27 28.11,39.27 27.98,39.4 | 66.11,39.4 67.23,40.52 IC9.14 | 66.11,39.4 52.98,39.4 52.86,39.52 | IC2.8 5.11,15.15 9.36,10.9 11.36,10.9 C1.2 11.48,10.65 11.48,4.52 ST2.B31 | 17.23,35.65 7.48,35.65 6.36,36.77 C6.2 | C7.2 17.23,35.65 | 27.98,39.4 24.23,35.65 17.23,35.65 | 27.98,39.4 29.11,40.52 IC6.10 | C12.2 43.11,67.4 41.98,68.52 31.61,68.52 30.48,67.4 C11.2 | IC6.1 28.86,63.15 22.48,63.15 18.48,59.15 C3.2 | X1.1@2 86.98,44.02 84.86,41.9 75.11,41.9 72.36,39.15 66.11,39.15 66.11,39.4
  pour Top: -2.54,100.97 102.87,100.97 102.87,7.62 -2.54,7.62
  pour Bottom: 102.87,100.97 -2.54,100.97 -2.54,7.62 102.87,7.62
IO_CS  (via drill 0.35)
  Top 0.381: v31.23,43.65 32.48,42.4 32.48,25.02 37.48,20.02 v37.48,19.4 | v59.23,14.4 64.73,8.9 64.73,4.52 ST2.A10
  Bottom 0.381: v31.23,43.65 30.48,44.4 28.23,44.4 27.36,45.27 25.23,45.27 24.86,45.65 IC4.10 | v37.48,19.4 38.86,18.02 40.36,18.02 43.98,14.4 v59.23,14.4
IOR  (via drill 0.35)
  Top 0.381: v69.98,75.52 73.61,71.9 73.61,37.15 75.48,35.27 75.48,34.52 69.73,28.77 v67.86,28.77 | v63.11,28.77 55.11,20.77 55.11,8.52 v54.98,8.4
  Bottom 0.381: v69.98,75.52 15.36,75.52 15.36,55.15 17.11,53.4 IC4.2 | v63.11,28.77 v67.86,28.77 | v54.98,8.4 54.98,4.52 54.73,4.52 ST2.B14
IOW  (via drill 0.35)
  Top 0.381: v21.86,44.4 22.11,44.15 22.11,30.52 22.98,29.65 22.98,22.4 23.86,21.52 29.98,21.52 29.98,15.02 30.48,14.52 30.48,13.52 31.36,12.65 32.86,12.65 32.86,12.15 32.98,12.02 v32.98,10.52
  Bottom 0.381: v21.86,44.4 18.48,44.4 17.23,45.65 IC4.5 | v32.98,10.52 33.36,10.15 51.36,10.15 52.23,9.27 55.36,9.27 57.11,7.52 57.11,4.52 ST2.B13
IRQ  (via drill 0.35)
  Top 0.381: v40.23,11.65 40.11,11.77 40.11,20.15 41.23,21.27 41.23,34.9 IC3.16
  Bottom 0.381: JP1.1 24.23,11.52 26.61,11.52 JP1.3 26.86,11.4 29.11,11.4 JP1.5 29.36,11.4 31.61,11.4 JP1.7 31.86,11.4 34.11,11.4 JP1.9 34.36,11.52 40.11,11.52 v40.23,11.65
IRQ2  (via drill 0.35)
  Top 0.381: v25.36,8.15 25.36,12.77 24.23,13.9 JP1.2
  Bottom 0.381: ST2.B25 26.67,6.99 25.51,8.15 v25.36,8.15
IRQ3  (via drill 0.35)
  Top 0.381: v27.98,8.15 27.98,12.65 26.73,13.9 JP1.4
  Bottom 0.381: v27.98,8.15 28.22,8.15 29.21,7.44 ST2.B24
IRQ4  (via drill 0.35)
  Top 0.381: v30.48,8.15 30.48,11.9 29.86,12.52 29.86,13.27 29.23,13.9 JP1.6
  Bottom 0.381: v30.48,8.15 30.59,8.15 31.75,6.99 ST2.B23
IRQ5  (via drill 0.35)
  Top 0.381: v35.98,15.27 36.73,14.52 v36.73,8.4
  Bottom 0.381: v35.98,15.27 33.11,15.27 31.86,14.02 JP1.8 | v36.73,8.4 36.48,8.15 35.86,8.15 34.36,6.65 34.36,4.52 ST2.B22
IRQ6  (via drill 0.35)
  Top 0.381: v37.61,14.02 37.86,13.77 v37.86,8.27
  Bottom 0.381: v37.61,14.02 34.36,14.02 JP1.10 | v37.86,8.27 37.86,8.01 36.83,6.99 ST2.B21
N$2  (via drill 0.35)
  Top 0.381: IC5.2 15.23,32.4 v15.23,41.15
  Bottom 0.381: v15.23,41.15 16.11,42.02 23.61,42.02 IC4.9
N$3
  Top 0.381: R6.2 86.48,31.15 86.98,31.65 86.98,35.52 Q2.1 87.11,35.65 91,39.54 91,47.12 88.61,49.52 X1.2
N$14  (via drill 0.35)
  Top 0.381: v31.61,40.27 29.98,38.65 29.98,28.02 24.86,22.9 IC5.10
  Bottom 0.381: v31.61,40.27 31.86,40.52 36.73,40.52 IC6.11
N$15  (via drill 0.35)
  Top 0.381: v22.86,19.77 24.73,17.9 IC5.8
  Bottom 0.381: v22.86,19.77 20.23,19.77 17.23,22.77 IC5.5
N$16
  Top 0.381: IC5.6 17.11,20.4 15.36,22.15 15.36,26.15 17.11,27.9 IC5.3
N$17  (via drill 0.35)
  Top 0.381: v60.23,32.02 62.73,34.52 62.73,40.02 62.23,40.52 IC8.11
  Bottom 0.381: v60.23,32.02 54.11,32.02 53.36,31.27 34.11,31.27 33.73,31.65 21.23,31.65 21.23,29.52 17.23,25.52 IC5.4
N$22
  Top 0.381: IC3.40 79.48,19.65 81.11,18.02 81.11,15.9 Q1.2
  Bottom 0.381: C4.1 84.36,12.15 81.23,15.27 81.23,15.77 Q1.2
N$23
  Top 0.381: IC3.39 76.73,19.65 76.36,19.27 76.36,15.9 Q1.1 76.23,15.9 72.48,12.15 C5.1
R/!W  (via drill 0.35)
  Top 0.381: v53.73,30.52 53.73,34.77 53.86,34.9 IC3.11 | v50.73,72.27 41.98,63.52 IC7.1 | v26.48,64.9 26.61,64.77 26.61,32.27 24.86,30.52 IC5.13
  Bottom 0.381: v53.73,30.52 24.86,30.52 IC5.13 | IC9.27 82.48,71.15 81.36,72.27 v50.73,72.27 50.61,72.15 33.73,72.15 v26.48,64.9
RESET  (via drill 0.35)
  Top 0.381: v85.36,15.27 85.86,14.77 v85.86,8.4
  Bottom 0.381: v85.36,15.27 79.86,20.77 65.23,20.77 64.23,19.77 IC3.34 | v85.86,8.4 85.86,7.7 85.74,7.7 ST2.B2
VA0  (via drill 0.35)
  Top 0.381: v46.86,76.4 38.61,68.15 38.61,60.27 36.86,58.52 IC6.18 | v69.98,77.52 74.48,73.02 v74.48,51.77
  Bottom 0.381: v46.86,76.4 47.98,77.52 v69.98,77.52 | v74.48,51.77 73.61,50.9 67.36,50.9 IC9.10
VA1  (via drill 0.35)
  Top 0.381: v42.23,66.15 40.11,64.02 40.11,55.65 39.36,54.9 39.36,52.15 35.73,52.15 34.98,52.9 34.98,54.02 36.73,55.77 IC6.17 | v70.86,69.77 70.86,54.52 v69.98,53.65
  Bottom 0.381: v42.23,66.15 45.48,66.15 49.11,69.77 v70.86,69.77 | v69.98,53.65 69.73,53.4 67.36,53.4 IC9.9
VA2  (via drill 0.35)
  Top 0.381: v46.86,73.02 39.36,65.52 39.36,55.9 36.86,53.4 IC6.16 | v69.98,58.52 v69.98,73.27
  Bottom 0.381: v46.86,73.02 48.61,74.77 68.48,74.77 v69.98,73.27 | v69.98,58.52 67.36,55.9 IC9.8
VA3  (via drill 0.35)
  Top 0.381: v43.36,52.15 45.98,54.77 45.98,63.15 v48.48,65.65 | v56.73,65.52 58.61,63.65 v58.61,58.9
  Bottom 0.381: v43.36,52.15 40.98,52.15 40.23,51.4 37.36,51.4 36.86,50.9 IC6.15 | v48.48,65.65 48.61,65.52 v56.73,65.52 | v58.61,58.9 60.23,57.27 64.86,57.27 65.98,58.4 67.23,58.4 IC9.7
VA4  (via drill 0.35)
  Top 0.381: v33.36,48.9 33.48,49.02 33.48,67.9 44.98,79.4 79.11,79.4 79.11,59.27 82.48,55.9 IC9.21
  Bottom 0.381: v33.36,48.9 36.11,48.9 36.73,48.27 IC6.14
VA5  (via drill 0.35)
  Top 0.381: v44.98,59.27 44.98,54.77 41.11,54.77 40.11,53.77 40.11,49.02 36.86,45.77 IC6.13
  Bottom 0.381: v44.98,59.27 45.48,59.77 65.36,59.77 66.48,60.9 67.23,60.9 IC9.6
VA6
  Top 0.381: IC6.12 36.73,43.27 34.23,45.77 34.23,67.65 44.98,78.4 69.11,78.4 69.11,65.27 67.36,63.52 IC9.5
VA7
  Bottom 0.381: IC8.18 62.23,58.52 62.73,59.02 65.61,59.02 66.23,59.65 81.23,59.65 82.48,60.9 IC9.23
VA8  (via drill 0.35)
  Top 0.381: v65.36,56.52 65.48,56.65 65.48,64.27 67.23,66.02 IC9.4
  Bottom 0.381: v65.36,56.52 62.86,56.52 62.23,55.9 IC8.17
VA9
  Top 0.381: IC8.16 62.23,53.4 64.48,55.65 64.48,65.77 67.23,68.52 IC9.3
VA10  (via drill 0.35)
  Top 0.381: v69.98,52.15 71.86,54.02 v71.86,60.52
  Bottom 0.381: v69.98,52.15 66.36,52.15 64.98,50.77 62.23,50.77 IC8.15 | v71.86,60.52 74.73,63.4 82.48,63.4 IC9.24
VA11  (via drill 0.35)
  Top 0.381: v59.48,50.02 59.48,64.9 65.61,71.02 67.23,71.02 IC9.2
  Bottom 0.381: v59.48,50.02 60.86,48.65 61.86,48.65 IC8.14
VA12  (via drill 0.35)
  Top 0.381: v74.48,50.52 78.23,54.27 v78.23,64.27
  Bottom 0.381: v74.48,50.52 71.11,47.15 63.61,47.15 62.23,45.77 IC8.13 | v78.23,64.27 79.98,66.02 82.48,66.02 IC9.25
VA13  (via drill 0.35)
  Top 0.381: v60.36,64.52 60.36,45.15 62.23,43.27 IC8.12
  Bottom 0.381: v60.36,64.52 63.23,67.4 81.36,67.4 82.48,68.52 IC9.26
VD0  (via drill 0.35)
  Top 0.381: IC3.32 59.11,19.77 59.73,20.4 59.73,24.15 65.48,29.9 65.48,46.4 67.23,48.15 IC9.11 | v52.73,52.52 52.73,57.77 49.61,60.9 IC7.19
  Bottom 0.381: v52.73,52.52 53.23,52.02 58.73,52.02 61.36,49.4 66.11,49.4 67.23,48.27 IC9.11
VD1  (via drill 0.35)
  Top 0.381: IC3.31 56.61,19.65 57.98,18.27 65.61,18.27 65.61,27.77 70.36,32.52 70.36,42.52 67.36,45.52 67.36,45.65 IC9.12 67.36,45.9 69.11,47.65 69.11,61.77 v68.73,62.15 | v57.73,62.15 48.48,62.15 47.73,61.4 47.73,60.27 49.48,58.52 IC7.18
  Bottom 0.381: v68.73,62.15 v57.73,62.15
VD2  (via drill 0.35)
  Top 0.381: v60.61,23.77 68.11,31.27 68.11,39.15 69.11,40.15 69.11,41.4 67.36,43.15 IC9.13
  Bottom 0.381: v60.61,23.77 57.98,23.77 53.98,19.77 IC3.30 | IC7.17 49.61,55.9 49.98,56.27 52.73,56.27 53.48,57.02 58.86,57.02 61.36,54.52 72.98,54.52 75.36,52.15 75.36,43.27 67.36,43.27 IC9.13
VD3  (via drill 0.35)
  Top 0.381: v51.98,24.02 51.98,20.27 51.48,19.77 IC3.29 | v73.11,25.52 82.48,34.9 82.48,40.52 IC9.15 | v60.73,37.27 58.36,39.65 58.36,48.15 57.61,48.9 57.61,52.02 53.61,52.02 52.73,51.15 52.73,51.02 51.86,51.02 49.61,53.27 IC7.16
  Bottom 0.381: v51.98,24.02 53.48,25.52 v73.11,25.52 | v60.73,37.27 61.23,36.77 68.48,36.77 68.61,36.65 77.86,36.65 81.73,40.52 82.48,40.52 IC9.15
VD4  (via drill 0.35)
  Top 0.381: v70.98,24.65 80.73,34.4 80.73,41.4 82.48,43.15 IC9.16 | v45.98,50.52 43.73,48.27 43.73,42.77 42.73,41.77 40.11,41.77 40.11,27.65 40.36,27.4 v40.36,25.4
  Bottom 0.381: 50.36,21.15 53.86,24.65 v70.98,24.65 | 50.36,21.15 IC3.28 | v45.98,50.52 49.23,50.52 49.48,50.77 IC7.15 | v40.36,25.4 42.11,23.65 47.86,23.65 50.36,21.15
VD5  (via drill 0.35)
  Top 0.381: IC3.27 46.36,29.52 50.61,33.77 52.61,33.77 | 52.61,33.77 52.61,45.15 49.61,48.15 IC7.14 | v78.86,36.4 78.86,42.02 82.48,45.65 IC9.17 | v52.73,33.77 52.61,33.77
  Bottom 0.381: v78.86,36.4 77.98,35.52 77.98,33.77 v52.73,33.77
VD6  (via drill 0.35)
  Top 0.381: 43.86,28.77 43.86,33.4 45.23,34.77 v45.23,46.52 | 43.86,28.77 43.86,19.77 IC3.26 | v73.36,29.9 77.98,34.52 77.98,43.65 82.48,48.15 IC9.18 | v43.98,28.77 43.86,28.77
  Bottom 0.381: v45.23,46.52 45.98,45.77 49.48,45.77 IC7.13 | v73.36,29.9 60.73,29.9 59.61,28.77 v43.98,28.77
VD7  (via drill 0.35)
  Top 0.381: v42.73,35.65 42.73,34.77 41.98,34.02 41.98,20.4 41.36,19.77 IC3.25 | v46.86,42.9 46.98,42.77 46.98,37.77 v46.23,37.02 47.48,35.77 47.48,34.77 v48.73,33.52
  Bottom 0.381: v42.73,35.65 44.11,37.02 v46.23,37.02 | v46.86,42.9 47.11,43.15 49.48,43.15 IC7.12 | v48.73,33.52 50.11,33.52 50.73,32.9 79.23,32.9 83.11,36.77 89.73,36.77 89.73,44.65 88.73,45.65 87.73,45.65 82.61,50.77 IC9.19

### Text on the board
tNames: TMS9918A V1 | 0= C C C C / 1= C C C X / 2= C C X C / 3= C C X X / 4= C X C C / 5= C X C X / 6= C X X C / 7= C X X X / 8= X C C C / 9= X C C X / A= X C X C / B= X C X X / X= X X C C / D= X X C X / E= X X X C / F= X X X X